# EasyEDA schematic MSX Keyboard USB.json
TITLE: Keyboard usb for MSX NMS 8250/55/80; REV: 1.0; Date: 2021-06-27; Sheet: 1/1; Drawn By: panyk.system; Company: PanyKSystem
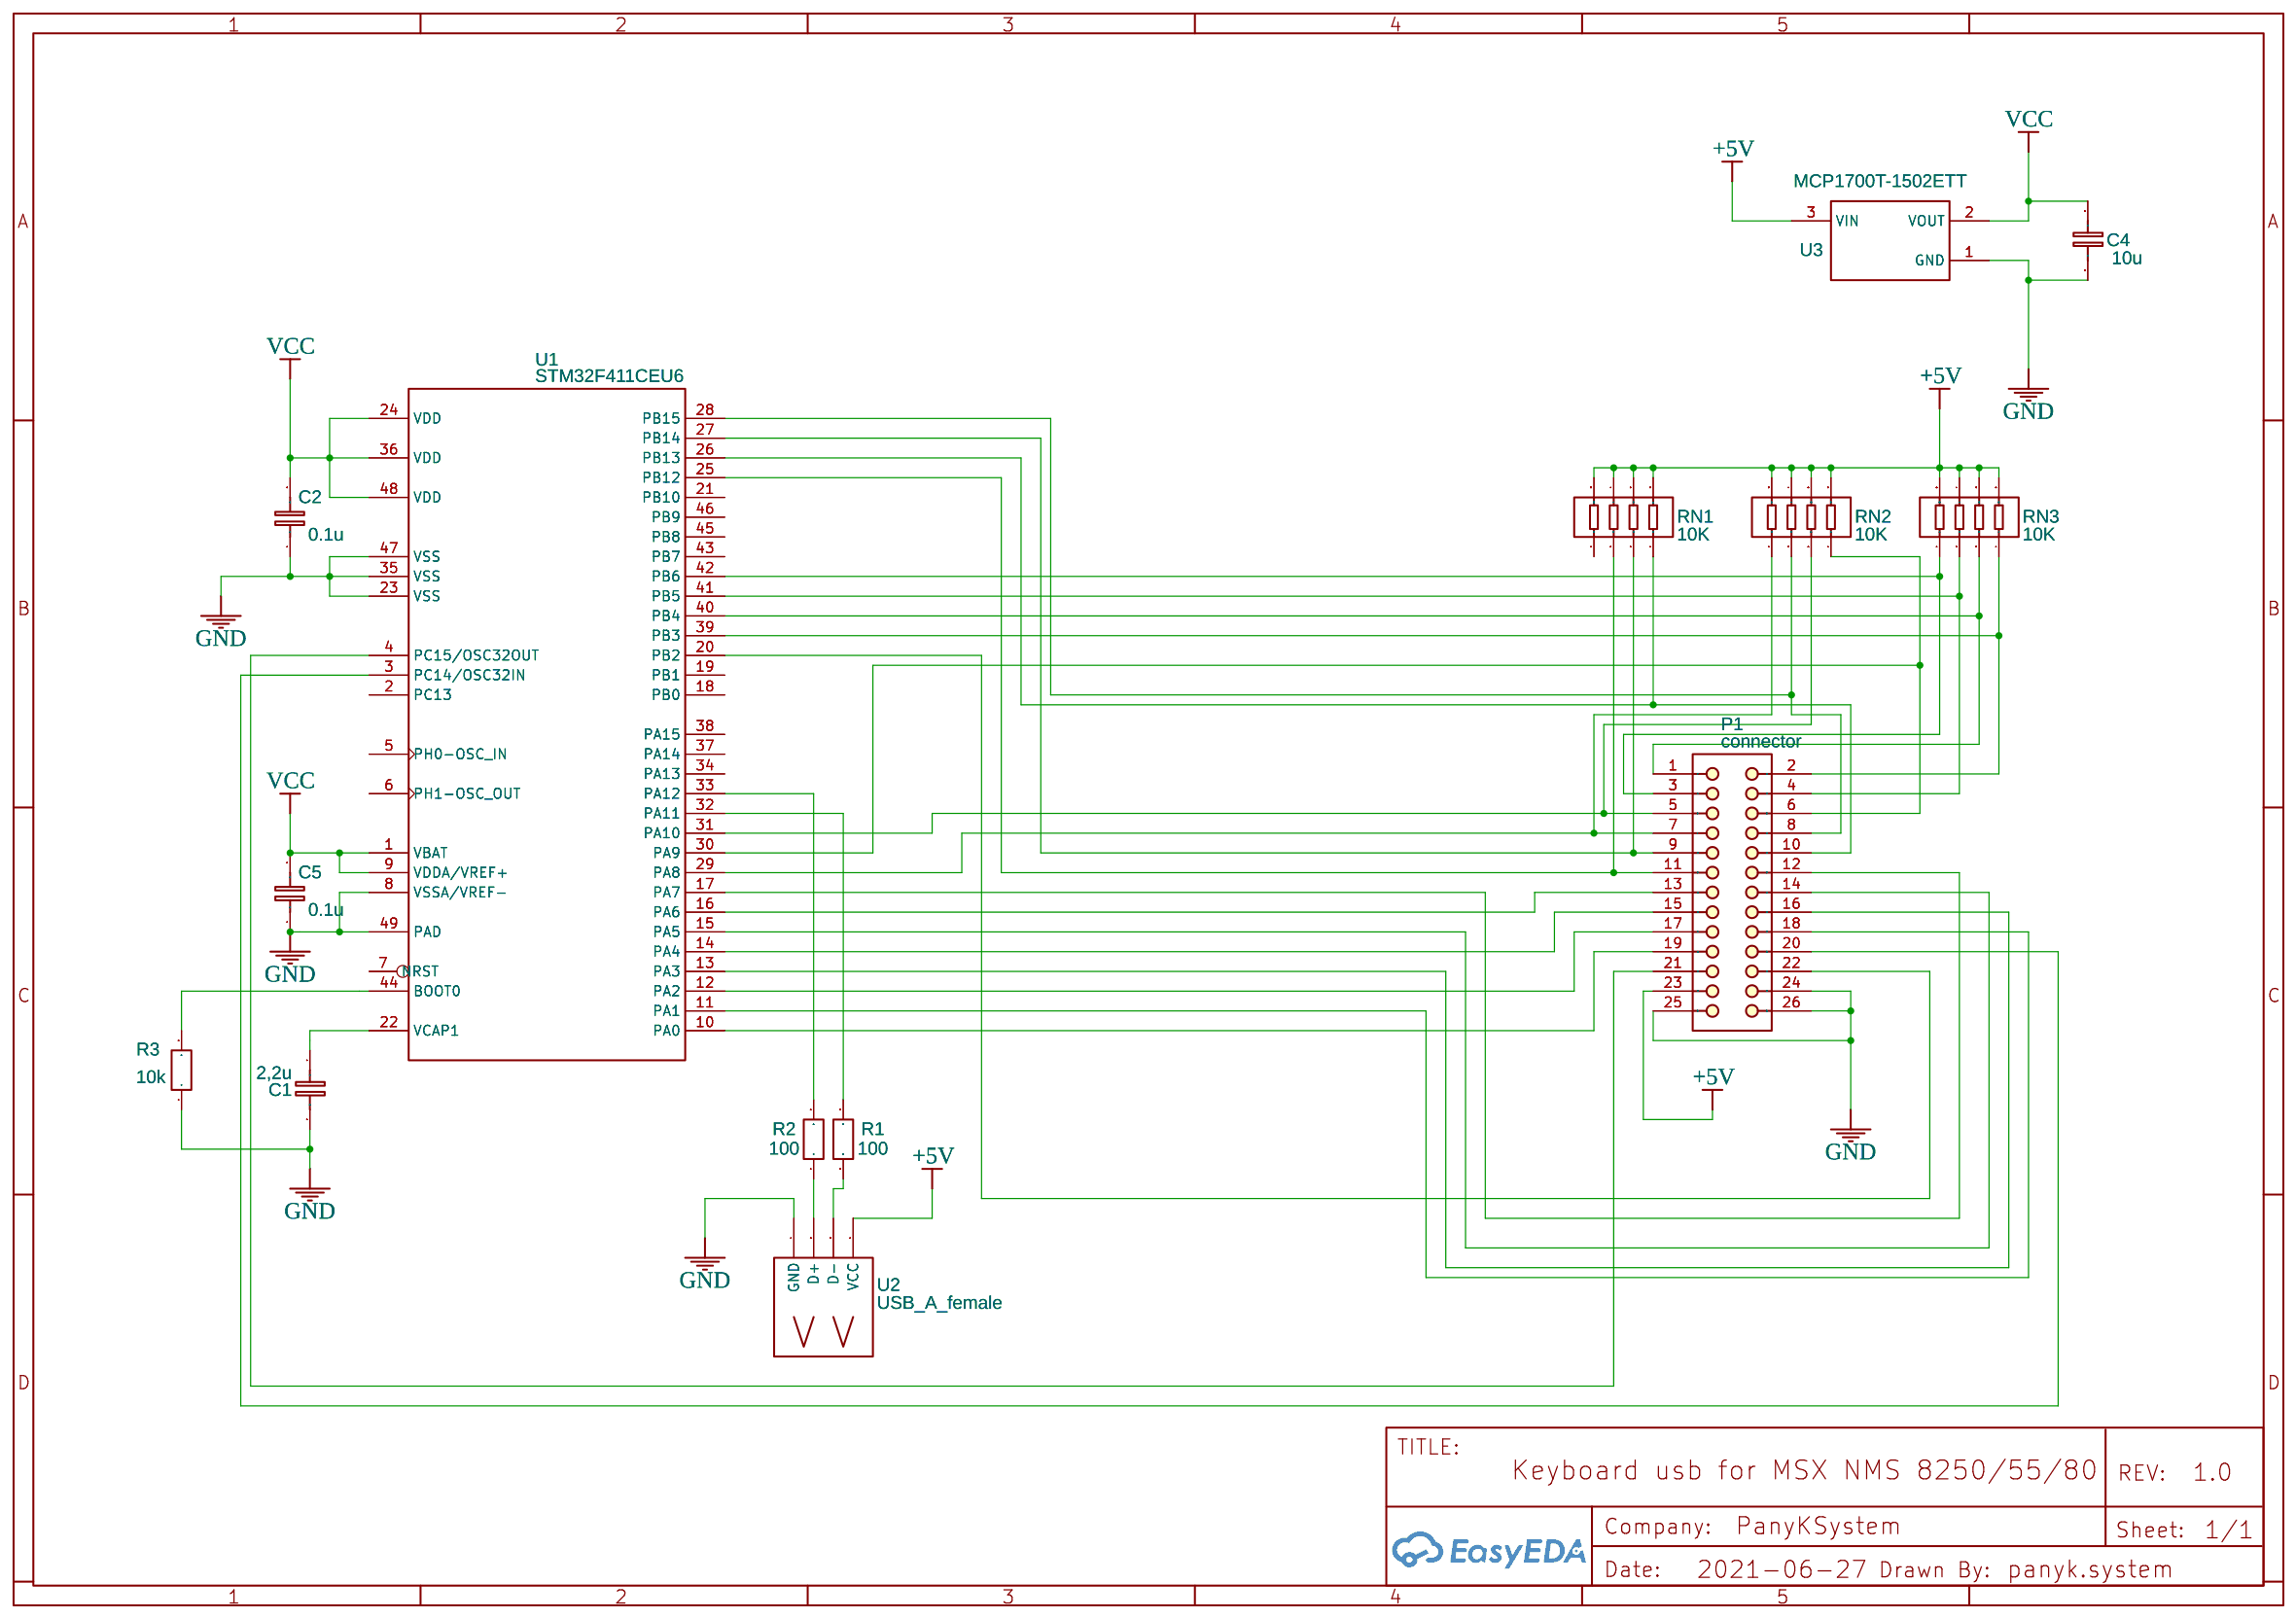
[diagram p0: schematic sheet]

## Parts
C1  2,2u  [C0805]
C2  0.1u  [C0805]
C4  10u  [C0805]
C5  0.1u  [C0805]
P1  connector  [CONNECTOR26]
R1  100  [R0603]
R2  100  [R0603]
R3  10k  [R0603]
RN1  10K  [RES-ARRAY-SMD_0603-8P-L3.2-W1.6-BL]
RN2  10K  [RES-ARRAY-SMD_0603-8P-L3.2-W1.6-BL]
RN3  10K  [RES-ARRAY-SMD_0603-8P-L3.2-W1.6-BL]
U1  STM32F411CEU6  [UFQFPN-48_L7.0-W7.0-P0.50-BL-EP]
U2  USB_A_female  [USB A FEMALE TH P4]
U3  MCP1700T-1502ETT  [SOT23-3]

## Library data of the parts
C1 C2 C4 C5 = C_0805_EU: Contributor: LCEDA_Lib
P1 = connector: Flat Cable Connector (IDC), PCB Transition Connector, 2 Rows, Solder Pin, 26 Contacts; Contributor: Watsapol
R1-R3 = R_0603_EU: Contributor: LCEDA_Lib
RN1-RN3 = 4D03WGF1002T5E: Supplier: LCSC; Supplier Part: C425238; Manufacturer: UNI-ROYAL(Uniroyal Elec); Contributor: LCSC
U1 = STM32F411CEU6: Supplier: LCSC; Manufacturer: STMicroelectronics; Supplier Part: C60420; JLCPCB Part Class: Extended Part
U2 = USB_A_female: Contributor: cultofsnake
U3 = MCP1700T-1502ETT: Low Quiescent Current LDO, 3-Pin SOT-23, Extended Temperature, Tape and Reel

## Nets
+5V: P1.23 RN1.5 RN1.6 RN1.7 RN1.8 RN2.5 RN2.6 RN2.7 RN2.8 RN3.5 RN3.6 RN3.7 RN3.8 U2.1(VCC) U3.3(VIN)
GND: C1.2 C2.1 C4.2 C5.1 P1.24 P1.25 P1.26 R3.1 U1.8(VSSA/VREF-) U1.23(VSS) U1.35(VSS) U1.47(VSS) U1.49(PAD) U2.4(GND) U3.1(GND)
VCC: C2.2 C4.1 C5.2 U1.1(VBAT) U1.9(VDDA/VREF+) U1.24(VDD) U1.36(VDD) U1.48(VDD) U3.2(VOUT)
Net-(C1-1): C1.1 U1.22(VCAP1)
Net-(P1-1): P1.1 RN3.3 U1.40(PB4)
Net-(P1-2): P1.2 RN3.4 U1.39(PB3)
Net-(P1-3): P1.3 RN3.1 U1.42(PB6)
Net-(P1-4): P1.4 RN3.2 U1.41(PB5)
Net-(P1-5): P1.5 RN2.3 U1.31(PA10)
Net-(P1-6): P1.6 RN2.4 U1.30(PA9)
Net-(P1-7): P1.7 RN2.1 U1.29(PA8)
Net-(P1-8): P1.8 RN2.2 U1.28(PB15)
Net-(P1-9): P1.9 RN1.3 U1.27(PB14)
Net-(P1-10): P1.10 RN1.4 U1.26(PB13)
Net-(P1-11): P1.11 RN1.2 U1.25(PB12)
Net-(P1-12): P1.12 U1.17(PA7)
Net-(P1-13): P1.13 U1.16(PA6)
Net-(P1-14): P1.14 U1.15(PA5)
Net-(P1-15): P1.15 U1.14(PA4)
Net-(P1-16): P1.16 U1.13(PA3)
Net-(P1-17): P1.17 U1.12(PA2)
Net-(P1-18): P1.18 U1.11(PA1)
Net-(P1-19): P1.19 U1.10(PA0)
Net-(P1-20): P1.20 U1.3(PC14/OSC32IN)
Net-(P1-21): P1.21 U1.4(PC15/OSC32OUT)
Net-(P1-22): P1.22 U1.20(PB2)
Net-(R1-1): R1.1 U2.2(D-)
Net-(R1-2): R1.2 U1.32(PA11)
Net-(R2-1): R2.1 U2.3(D+)
Net-(R2-2): R2.2 U1.33(PA12)
Net-(R3-2): R3.2 U1.44(BOOT0)

Not connected (* = marked no-connect by the designer): RN1 1; U1 2(PC13) 5(PH0-OSC_IN) 6(PH1-OSC_OUT) 7(NRST) 18(PB0) 19(PB1) 21(PB10) 34(PA13) 37(PA14) 38(PA15) 43(PB7) 45(PB8) 46(PB9)
